# EAGLE design Arduino Shield (EAGLE 9.2.2)
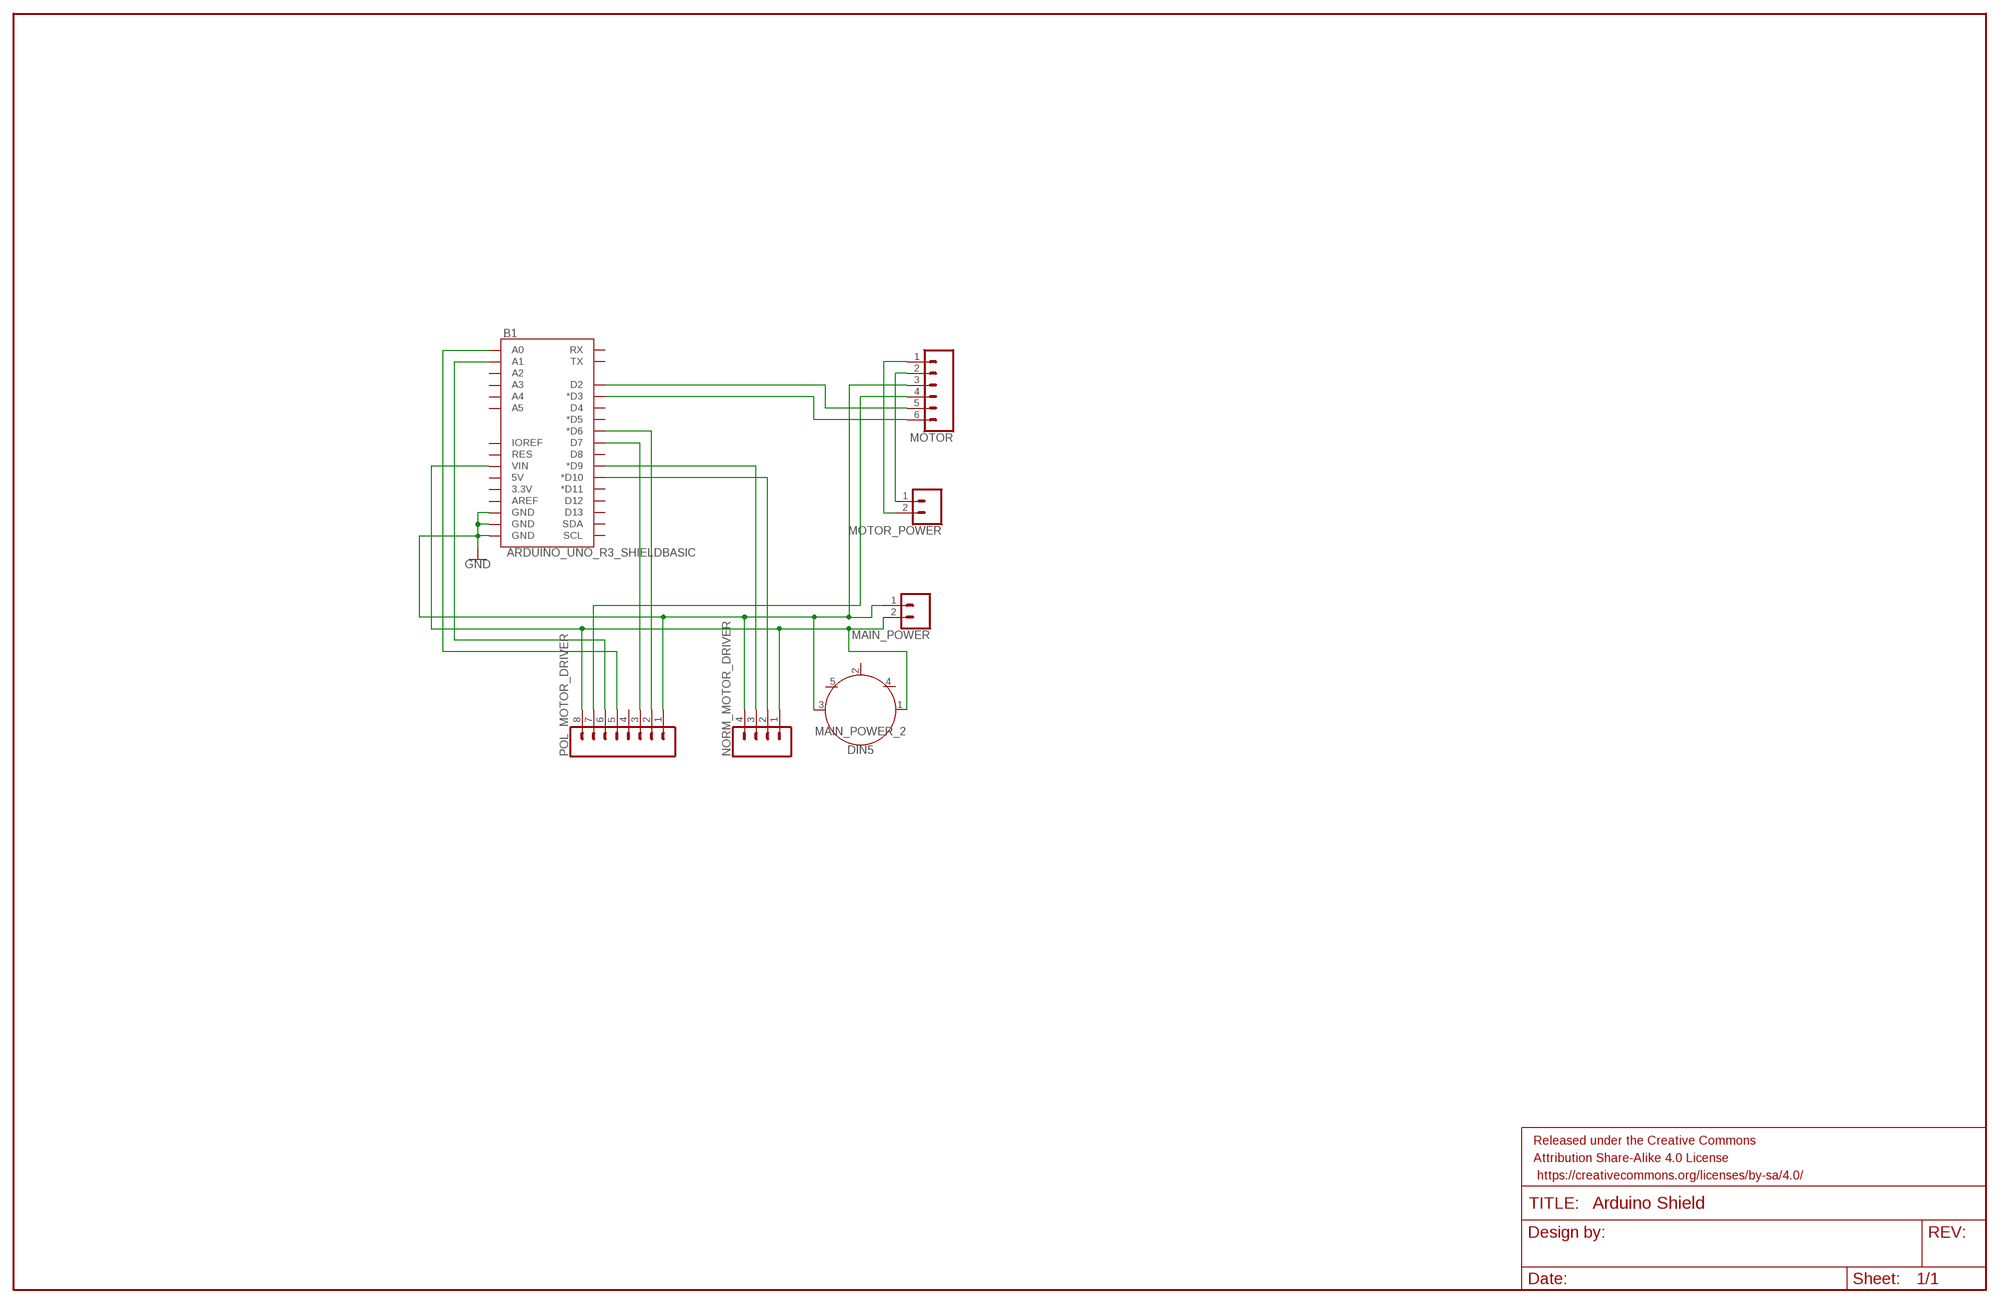
[diagram p0: schematic, sheet 1]

## Parts
B1  ARDUINO_UNO_R3_SHIELDBASIC  [UNO_R3_SHIELD]
FRAME1  FRAME-LEDGER  [CREATIVE_COMMONS]
MAIN_POWER  CONN_02-JST-2-PTH-NO_SILK  [JST-2-PTH-NS]
MAIN_POWER_2  DIN5  [DIN5-RA-PTH]
MOTOR  CONN_06SILK_FEMALE_PTH  [1X06]
MOTOR_POWER  CONN_02-JST-2-PTH-NO_SILK  [JST-2-PTH-NS]
NORM_MOTOR_DRIVER  CONN_04JST-PTH  [JST-4-PTH]
POL_MOTOR_DRIVER  CONN_08"  [1X08]

## Nets
GND: B1.GND@0(GND) B1.GND@1(GND) B1.GND@2(GND) MAIN_POWER.1 MAIN_POWER_2.3 MOTOR.3 NORM_MOTOR_DRIVER.4 POL_MOTOR_DRIVER.1
N$1: B1.D2 MOTOR.5
N$2: MOTOR.4 POL_MOTOR_DRIVER.7
N$3: B1.D3(*D3) MOTOR.6
N$4: B1.VIN MAIN_POWER.2 MAIN_POWER_2.1 NORM_MOTOR_DRIVER.1 POL_MOTOR_DRIVER.8
N$5: B1.A1 POL_MOTOR_DRIVER.6
N$6: B1.A0 POL_MOTOR_DRIVER.5
N$7: B1.D7 POL_MOTOR_DRIVER.3
N$8: B1.D6(*D6) POL_MOTOR_DRIVER.2
N$9: MOTOR.2 MOTOR_POWER.1
N$10: MOTOR.1 MOTOR_POWER.2
N$11: B1.D9(*D9) NORM_MOTOR_DRIVER.3
N$12: B1.D10(*D10) NORM_MOTOR_DRIVER.2
Unconnected: B1.3.3V B1.5V B1.A2 B1.A3 B1.A4 B1.A5 B1.AREF B1.D4 B1.D5(*D5) B1.D8 B1.D11(*D11) B1.D12 B1.D13 B1.IOREF B1.RES B1.RX B1.SCL B1.SDA B1.TX MAIN_POWER_2.2 MAIN_POWER_2.4 MAIN_POWER_2.5 POL_MOTOR_DRIVER.4

## Library data of the parts
B1 = SparkFun-Boards:ARDUINO_UNO_R3_SHIELD: Arduino R3 Shield Footprint Shield form compatible with the Arduino Uno R3. SparkFun Products: MG2639 Cellular Shield <https://www.sparkfun.com/products/13120> MIDI Shield <https://www.sparkfun.com/products/12898> R3 Stackable Headers Kit <https://www.sparkfun.com/products/11417>
FRAME1 = SparkFun-Aesthetics:FRAME-LEDGER: Schematic Frame - Ledger Standard 11x14 US Ledger frame
MAIN_POWER MOTOR_POWER = SparkFun-Connectors:CONN_02: Multi connection point. Often used as Generic Header-pin footprint for 0.1 inch spaced/style header connections On any of the 0.1 inch spaced packages, you can populate with these: Break Away Headers - Straight <https://www.sparkfun.com/products/116> (PRT-00116) Break Away Male Headers - Right Angle <https://www.sparkfun.com/products/553> (PRT-00553) Female Headers <https://www.sparkfun.com/products/115> (PRT-00115) Break Away Headers - Machine Pin <https://www.sparkfun.com/products/117> (PRT-00117) Break Away Female Headers - Swiss Machine Pin <https://www.sparkfun.com/products/743> (PRT-00743) For SCREWTERMINALS and SPRING TERMINALS visit here: Screw Terimnals on SparkFun.com <https://www.sparkfun.com/search/results?term=Screw+Terminals> (5mm/3.5mm/2.54mm spacing) This device is also useful as a general connection point to wire up your design to another part of your project. Our various solder wires solder well into these plated through hole pads. Hook-Up Wire - Assortment (Stranded, 22 AWG) <https://www.sparkfun.com/products/11375> (PRT-11375) Hook-Up Wire - Assortment (Solid Core, 22 AWG) <https://www.sparkfun.com/products/11367> (PRT-11367) View the entire wire category on our website here <https://www.sparkfun.com/categories/141> Special notes: Molex polarized connector foot print use with: PRT-08233 with associated crimp pins and housings. 2.54_SCREWTERM for use with PRT-10571. 3.5mm Screw Terminal footprints for PRT-08084 5mm Screw Terminal footprints for use with PRT-08432
MAIN_POWER_2 = SparkFun-Connectors:DIN5: DIN5 Connector - Female Right Angle (frequently used as a MIDI Jack connector) This type of connector and cable is frequently used for transmitting midi data (musical instrument digital interface). It is what you usually see on a keyboard or set of electronic drums. Learn more here <https://en.wikipedia.org/wiki/MIDI>. For more information on the pinout and electrical specifications of MIDI communications, please see the following resource: https://www.midi.org/specifications/item/midi-din-electrical-specification Here is the connector we sell at SparkFun: MIDI Connector - Female Right Angle <https://www.sparkfun.com/products/9536> (PRT-09536) Datasheet <hhttp://www.sparkfun.com/datasheets/Prototyping/Connectors/MIDI-RA.pdf> It is used on this SparkFun product: SparkFun MIDI Shield <https://www.sparkfun.com/products/12898> (DEV-12898); PROD_ID: CONN-09481
MOTOR = SparkFun-Connectors:CONN_06: Multi connection point. Often used as Generic Header-pin footprint for 0.1 inch spaced/style header connections On any of the 0.1 inch spaced packages, you can populate with these: Break Away Headers - Straight <https://www.sparkfun.com/products/116> (PRT-00116) Break Away Male Headers - Right Angle <https://www.sparkfun.com/products/553> (PRT-00553) Female Headers <https://www.sparkfun.com/products/115> (PRT-00115) Break Away Headers - Machine Pin <https://www.sparkfun.com/products/117> (PRT-00117) Break Away Female Headers - Swiss Machine Pin <https://www.sparkfun.com/products/743> (PRT-00743) Arduino Stackable Header - 6 Pin <https://www.sparkfun.com/products/9280> (PRT-09280) For SCREWTERMINALS and SPRING TERMINALS visit here: Screw Terimnals on SparkFun.com <https://www.sparkfun.com/search/results?term=Screw+Terminals> (5mm/3.5mm/2.54mm spacing) This device is also useful as a general connection point to wire up your design to another part of your project. Our various solder wires solder well into these plated through hole pads. Hook-Up Wire - Assortment (Stranded, 22 AWG) <https://www.sparkfun.com/products/11375> (PRT-11375) Hook-Up Wire - Assortment (Solid Core, 22 AWG) <https://www.sparkfun.com/products/11367> (PRT-11367) View the entire wire category on our website here <https://www.sparkfun.com/categories/141>; PROD_ID: CONN-08437
NORM_MOTOR_DRIVER = SparkFun-Connectors:CONN_04: Multi connection point. Often used as Generic Header-pin footprint for 0.1 inch spaced/style header connections On any of the 0.1 inch spaced packages, you can populate with these: Break Away Headers - Straight <https://www.sparkfun.com/products/116> (PRT-00116) Break Away Male Headers - Right Angle <https://www.sparkfun.com/products/553> (PRT-00553) Female Headers <https://www.sparkfun.com/products/115> (PRT-00115) Break Away Headers - Machine Pin <https://www.sparkfun.com/products/117> (PRT-00117) Break Away Female Headers - Swiss Machine Pin <https://www.sparkfun.com/products/743> (PRT-00743) For SCREWTERMINALS and SPRING TERMINALS visit here: Screw Terimnals on SparkFun.com <https://www.sparkfun.com/search/results?term=Screw+Terminals> (5mm/3.5mm/2.54mm spacing) This device is also useful as a general connection point to wire up your design to another part of your project. Our various solder wires solder well into these plated through hole pads. Hook-Up Wire - Assortment (Stranded, 22 AWG) <https://www.sparkfun.com/products/11375> (PRT-11375) Hook-Up Wire - Assortment (Solid Core, 22 AWG) <https://www.sparkfun.com/products/11367> (PRT-11367) View the entire wire category on our website here <https://www.sparkfun.com/categories/141> Special notes: Molex polarized connector foot print use with SKU : PRT-08231 with associated crimp pins and housings. 1MM SMD Version SKU: PRT-10208; PROD_ID: WIRE-13531; SF_ID: PRT-09916
POL_MOTOR_DRIVER = SparkFun-Connectors:CONN_08: Multi connection point. Often used as Generic Header-pin footprint for 0.1 inch spaced/style header connections On any of the 0.1 inch spaced packages, you can populate with these: Break Away Headers - Straight <https://www.sparkfun.com/products/116> (PRT-00116) Break Away Male Headers - Right Angle <https://www.sparkfun.com/products/553> (PRT-00553) Female Headers <https://www.sparkfun.com/products/115> (PRT-00115) Break Away Headers - Machine Pin <https://www.sparkfun.com/products/117> (PRT-00117) Break Away Female Headers - Swiss Machine Pin <https://www.sparkfun.com/products/743> (PRT-00743) Arduino Stackable Header - 8 Pin <https://www.sparkfun.com/products/9279> (PRT-09279) For SCREWTERMINALS and SPRING TERMINALS visit here: Screw Terimnals on SparkFun.com <https://www.sparkfun.com/search/results?term=Screw+Terminals> (5mm/3.5mm/2.54mm spacing) This device is also useful as a general connection point to wire up your design to another part of your project. Our various solder wires solder well into these plated through hole pads. Hook-Up Wire - Assortment (Stranded, 22 AWG) <https://www.sparkfun.com/products/11375> (PRT-11375) Hook-Up Wire - Assortment (Solid Core, 22 AWG) <https://www.sparkfun.com/products/11367> (PRT-11367) View the entire wire category on our website here <https://www.sparkfun.com/categories/141> Special notes: Molex polarized connector foot print use with SKU : PRT-08231 with associated crimp pins and housings. 1MM SMD Version SKU: PRT-10208 NOTES ON THE VARIANTS LOCK and LOCK_LONGPADS... This footprint was designed to help hold the alignment of a through-hole component (i.e. 6-pin header) while soldering it into place. You may notice that each hole has been shifted either up or down by 0.005 of an inch from it's more standard position (which is a perfectly straight line). This slight alteration caused the pins (the squares in the middle) to touch the edges of the holes. Because they are alternating, it causes a "brace" to hold the component in place. 0.005 has proven to be the perfect amount of "off-center" position when using our standard breakaway headers. Although looks a little odd when you look at the bare footprint, once you have a header in there, the alteration is very hard to notice. Also,if you push a header all the way into place, it is covered up entirely on the bottom side.; PROD_ID: CONN-08438

## Board
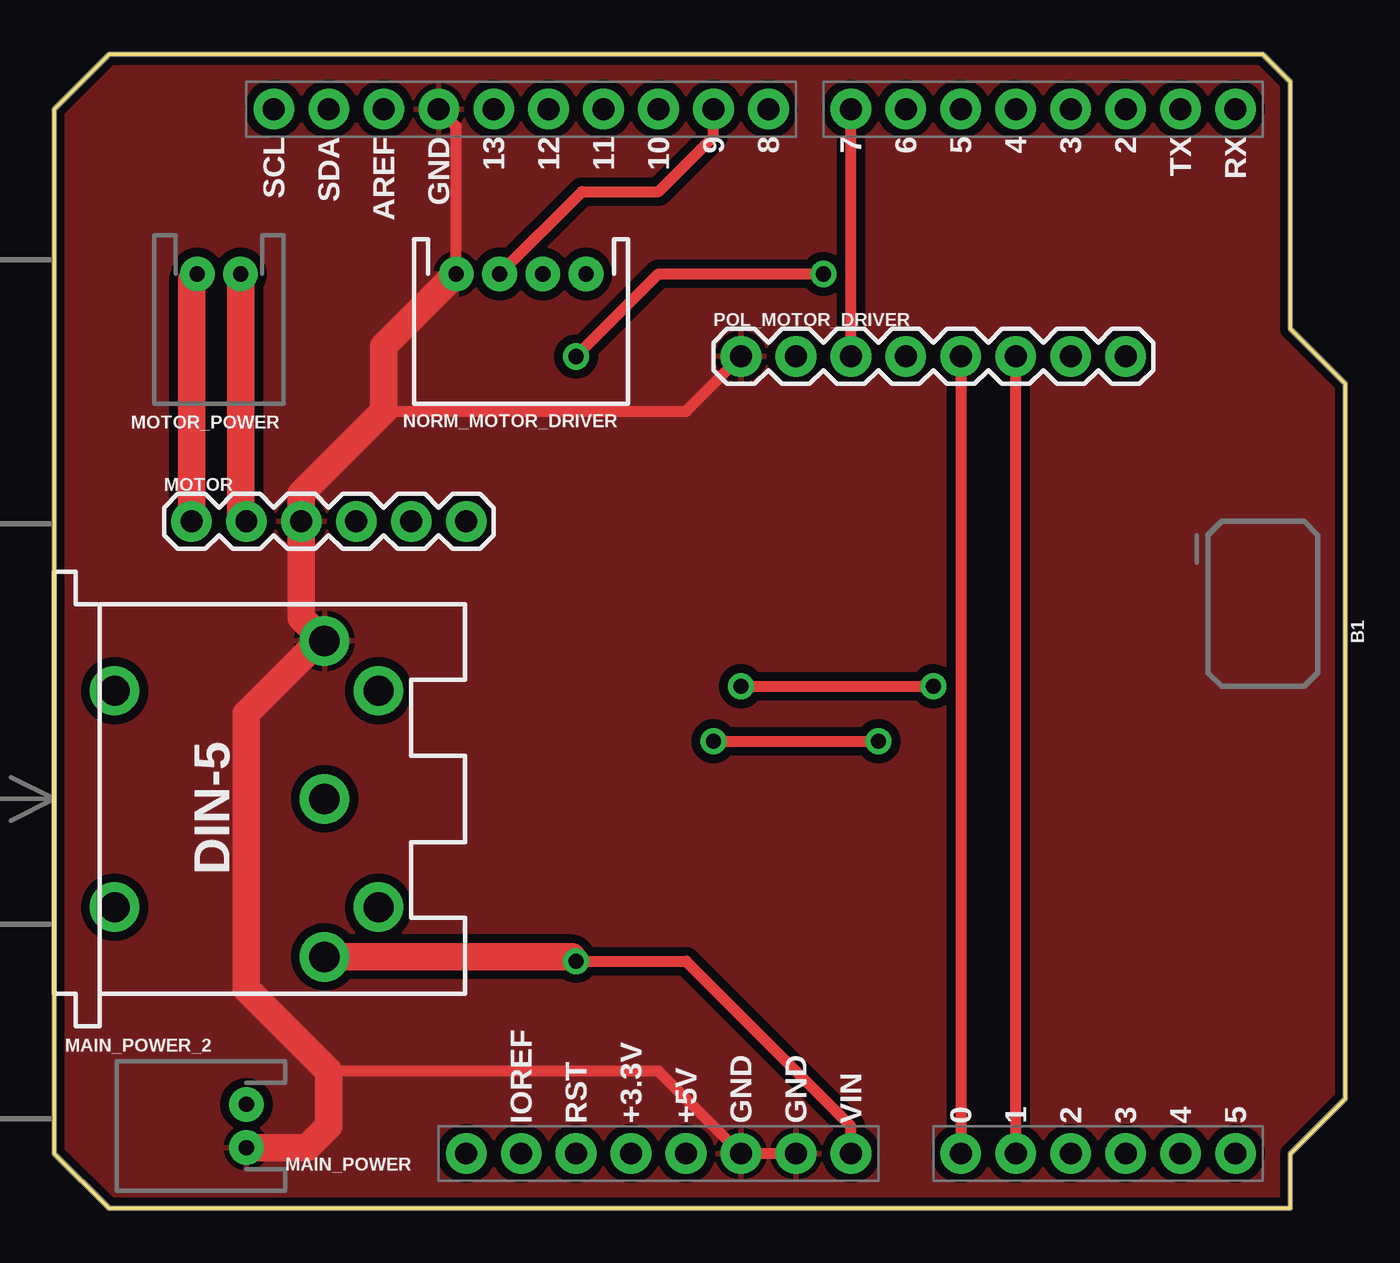
[diagram p1: board, top side]
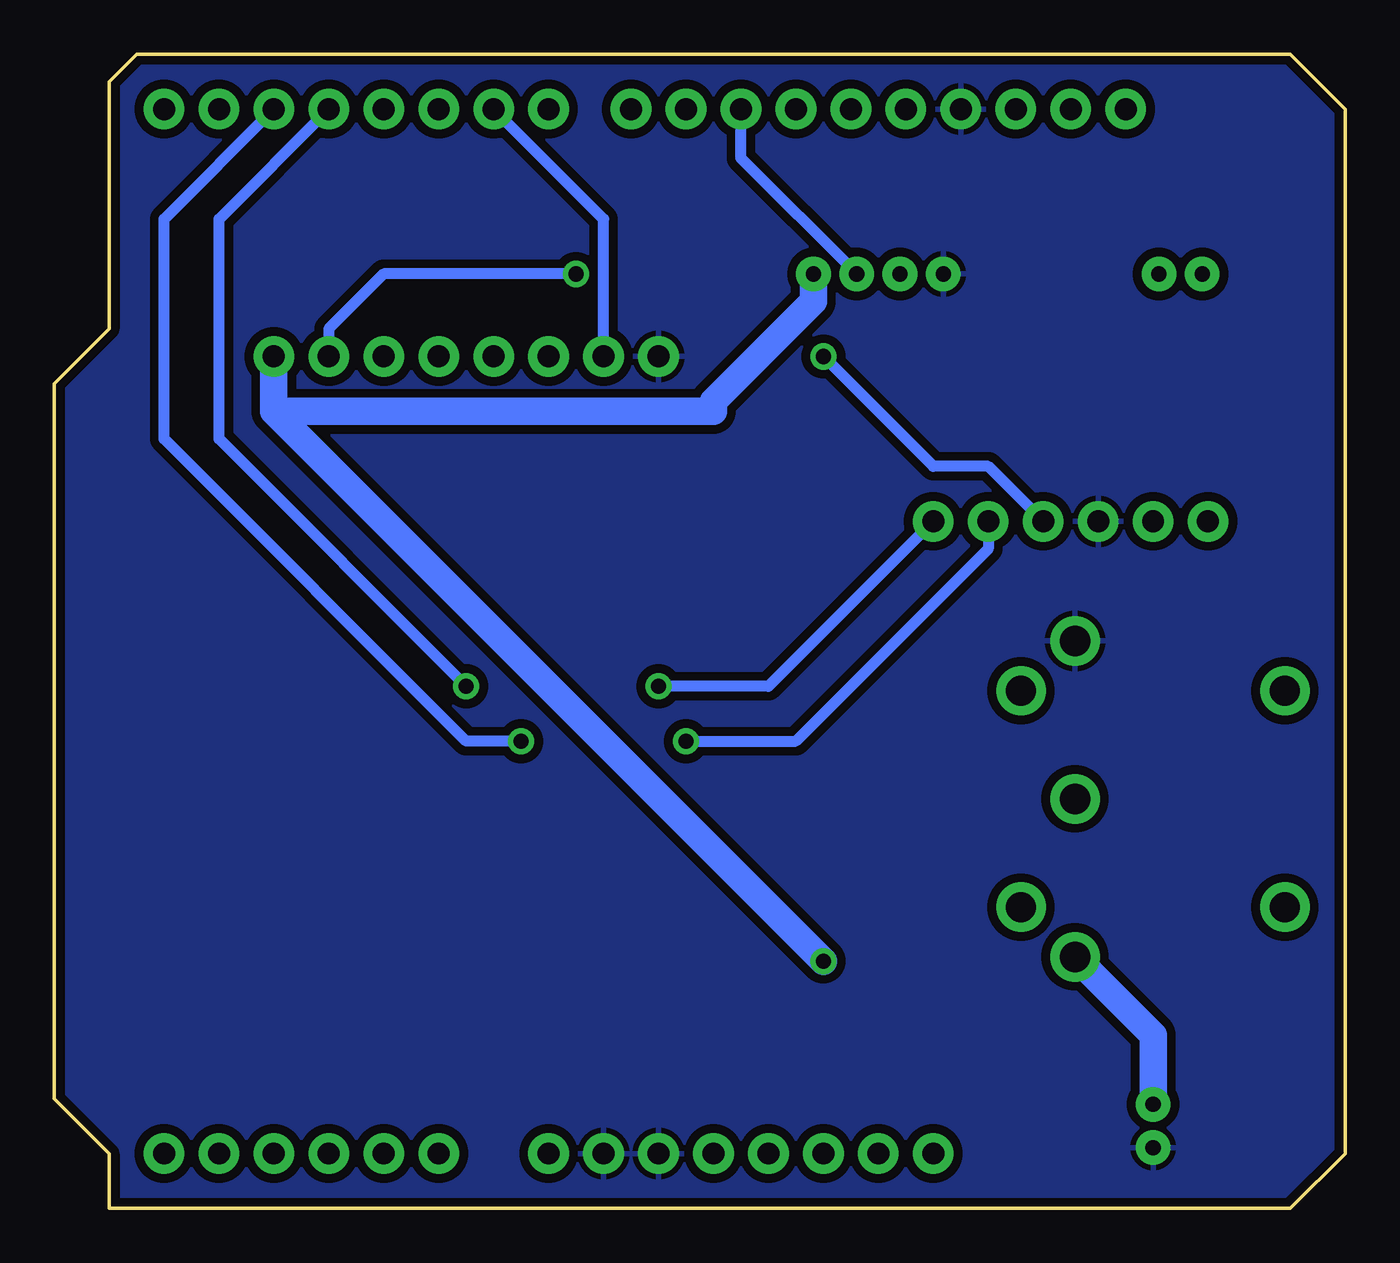
[diagram p2: board, bottom side, seen from below]

Size 59.69 x 53.34 mm. Coordinates in mm from the lower left corner, seen from the top.
Outline: 0,2.54 0,50.8 2.54,53.34 55.88,53.34 57.15,52.07 57.15,40.64 59.69,38.1 59.69,5.08 57.15,2.54 57.15,0 2.54,0 0,2.54
Copper layers (1*16): Top 0.035mm / dielectric 1.5mm / Bottom 0.035mm
Design rules "SparkFun-2-layer-STANDARD": minimum track width 10mil, minimum drill 20mil, track to track 10mil, track to pad 8mil, pad to pad 8mil, via to via 10mil, smd to smd 8mil, copper to edge 8mil, drill to drill 8mil, minimum pad ring 10mil, minimum via ring 10mil, stop-mask expansion 4mil, vias tented up to drill 25mil, thermal gap 10mil

### Footprints (pad centres in the part's own frame; a part is rotated, then mirrored left to right if it is on the bottom)
UNO_R3_SHIELD = drill 1.016 pad 1.88: 3.3V 24.13,-2.54; 5V 24.13,0; A0 24.13,12.7; A1 24.13,15.24; A2 24.13,17.78; A3 24.13,20.32; A4 24.13,22.86; A5 24.13,25.4; AREF -24.13,-13.97; D2 -24.13,20.32; D3 -24.13,17.78; D4 -24.13,15.24; D5 -24.13,12.7; D6 -24.13,10.16; D7 -24.13,7.62; D8 -24.13,3.81; D9 -24.13,1.27; D10 -24.13,-1.27; D11 -24.13,-3.81; D12 -24.13,-6.35; D13 -24.13,-8.89; GND@0 24.13,2.54; GND@1 24.13,5.08; GND@2 -24.13,-11.43; IOREF 24.13,-7.62; NC 24.13,-10.16; RES 24.13,-5.08; RX -24.13,25.4; SCL -24.13,-19.05; SDA -24.13,-16.51; TX -24.13,22.86; VIN 24.13,7.62
JST-2-PTH-NS = drill 0.7 pad 1.6: 1 -1,0; 2 1,0
DIN5-RA-PTH = drill 1.4 pad 2.286: 1 7.3,12.5; 2 0,12.5; 3 -7.3,12.5; 4 5,15; 5 -5,15; 6 -5,2.8; 7 5,2.8
1X06 = drill 1.016 pad 1.88: 1 0,0; 2 2.54,0; 3 5.08,0; 4 7.62,0; 5 10.16,0; 6 12.7,0
JST-4-PTH = drill 0.7 pad 1.6: 1 -3,0; 2 -1,0; 3 1,0; 4 3,0
1X08 = drill 1.016 pad 1.88: 1 0,0; 2 2.54,0; 3 5.08,0; 4 7.62,0; 5 10.16,0; 6 12.7,0; 7 15.24,0; 8 17.78,0

### Placement (x,y rotation side)
B1  29.21,26.67 270 top
FRAME1  -80.01,78.74 0 top  (outside the outline)
MAIN_POWER  8.89,3.81 90 top
MAIN_POWER_2  0,18.92 270 top
MOTOR  6.35,31.75 0 top
MOTOR_POWER  7.62,43.18 180 top
NORM_MOTOR_DRIVER  21.59,43.18 180 top
POL_MOTOR_DRIVER  31.75,39.37 0 top

### Tracks (layer width: path | path; a pad name or v marks a point on that pad's centre or on a via)
GND
  Top 0.508: 15.24,36.83 29.21,36.83 POL_MOTOR_DRIVER.1 | NORM_MOTOR_DRIVER.4 18.59,49.99 B1.GND@2 | MAIN_POWER_2.3 12.25,26.22 | B1.GND@1 B1.GND@0 27.94,6.35 12.7,6.35
  Top 1.27: NORM_MOTOR_DRIVER.4 15.24,39.83 15.24,36.83 11.43,33.02 MOTOR.3 11.43,27.29 MAIN_POWER_2.3 | 12.25,26.22 8.89,22.86 8.89,10.16 12.7,6.35 12.7,3.81 11.7,2.81 MAIN_POWER.1
  pour Bottom (isolate 0.406): 0,53.34 0,0 59.69,0 59.69,53.34 58.42,54.61 1.27,54.61
  pour Top (isolate 0.406): 0,53.34 0,2.54 2.54,0 57.15,0 59.69,0 59.69,52.07 58.42,53.34
N$1  (via drill 0.7)
  Top 0.508: v30.48,21.59 v38.1,21.59
  Bottom 0.508: MOTOR.5 16.51,30.48 25.4,21.59 v30.48,21.59 | v38.1,21.59 40.64,21.59 54.61,35.56 54.61,45.72 B1.D2
N$2  (via drill 0.7)
  Top 0.508: v24.13,39.37 27.94,43.18 v35.56,43.18
  Bottom 0.508: MOTOR.4 16.51,34.29 19.05,34.29 v24.13,39.37 | v35.56,43.18 44.45,43.18 46.99,40.64 POL_MOTOR_DRIVER.7
N$3  (via drill 0.7)
  Top 0.508: v31.75,24.13 v40.64,24.13
  Bottom 0.508: MOTOR.6 26.67,24.13 v31.75,24.13 | v40.64,24.13 52.07,35.56 52.07,45.72 B1.D3
N$4  (via drill 0.7)
  Top 0.305: v24.13,11.43 23.94,11.62
  Top 0.508: B1.VIN 36.83,3.81 29.21,11.43 v24.13,11.43
  Top 1.27: 23.94,11.62 MAIN_POWER_2.1
  Bottom 1.27: v24.13,11.43 49.53,36.83 | POL_MOTOR_DRIVER.8 49.53,36.83 | 49.53,36.83 29.21,36.83 29.21,37.29 24.59,41.91 NORM_MOTOR_DRIVER.1 | MAIN_POWER.2 8.89,8.01 MAIN_POWER_2.1
N$5
  Top 0.508: B1.A1 POL_MOTOR_DRIVER.6
N$6
  Top 0.508: POL_MOTOR_DRIVER.5 B1.A0
N$7
  Top 0.508: POL_MOTOR_DRIVER.3 B1.D7
N$8
  Bottom 0.508: POL_MOTOR_DRIVER.2 34.29,45.72 B1.D6
N$9
  Top 1.27: MOTOR_POWER.1 8.62,32.02 MOTOR.2
N$10
  Top 1.27: MOTOR.1 6.35,42.91 MOTOR_POWER.2
N$11
  Top 0.508: NORM_MOTOR_DRIVER.3 24.4,46.99 27.94,46.99 30.48,49.53 B1.D9
N$12
  Bottom 0.508: NORM_MOTOR_DRIVER.2 27.94,48.53 B1.D10